# Altium project Q-Dice.PrjPcb
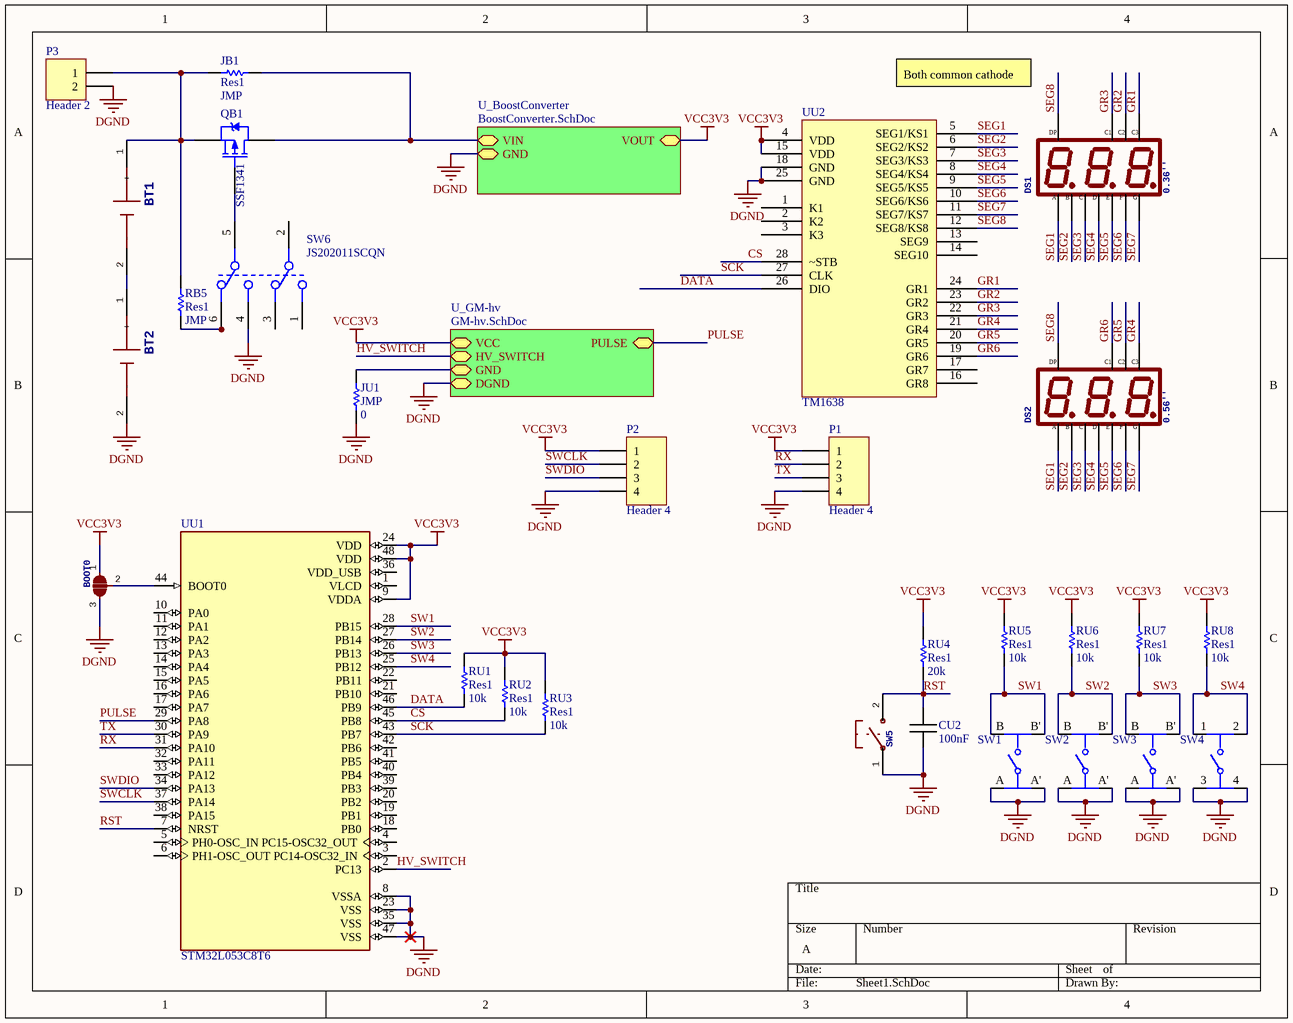
[diagram p0: Sheet1.SchDoc]
3 sheets, 71 parts. Net scope: strictly hierarchical (ports join the sheet entries above them; power ports are local).
Board file: Q-Dice.PcbDoc
Sheets:
  Sheet1.SchDoc
    U_GM-hv = GM-hv.SchDoc
    U_BoostConverter = BoostConverter.SchDoc

## Sheet Sheet1.SchDoc
size A

### Parts
BOOT0  2-Way Solder Jumper  [SOLDERJUMPER_2WAY_OPEN_NOPASTE]  (value not drawn)
BT1  Holder Cr2032 Gold Leads Smd  [AAA holder smd]  (value not drawn)
BT2  Holder Cr2032 Gold Leads Smd  [AAA holder smd]  (value not drawn)
CU2  100nF  [CAP0603R]
DS1  0.36''  [7-seg 3bit 0.36]
DS2  0.56''  [BA56-12EWA]
JB1  Res1  value JMP  [RES0603R]
JU1  JMP  value 0  [RES0603R]
P1  Header 4  [HDR1X4]
P2  Header 4  [HDR1X4]
P3  Header 2  [HDR1X2]
QB1  SSF1341  [SOT23]
RB5  Res1  value JMP  [RES0603R]
RU1  Res1  value 10k  [RES0603R]
RU2  Res1  value 10k  [RES0603R]
RU3  Res1  value 10k  [RES0603R]
RU4  Res1  value 20k  [RES0603R]
RU5  Res1  value 10k  [RES0603R]
RU6  Res1  value 10k  [RES0603R]
RU7  Res1  value 10k  [RES0603R]
RU8  Res1  value 10k  [RES0603R]
SW1  EVQ-PAE05R  [FP-EVQ-PAE05R-MFG]  (value not drawn)
SW2  EVQ-PAE05R  [FP-EVQ-PAE05R-MFG]  (value not drawn)
SW3  EVQ-PAE05R  [FP-EVQ-PAE05R-MFG]  (value not drawn)
SW4  FSM100  [FP-FSM100-MFG]  (value not drawn)
SW5  Switch  [PUSH_SMD_3x4]  (value not drawn)
SW6  JS202011SCQN  [JS202011SCQN]
UU1  STM32L053C8T6  [LQFP48_7X7MM_0.5MMPP]
UU2  TM1638  [SOP-28]

### Sub-sheets
U_BoostConverter = BoostConverter.SchDoc: VIN (bidir), GND (bidir), VOUT (bidir)
U_GM-hv = GM-hv.SchDoc: VCC (bidir), GND (bidir), PULSE (bidir), HV_SWITCH (bidir), DGND (bidir)

### Nets
DGND: BOOT0.3 BT2.2(-) CU2.2 JU1.1 P1.4 P2.4 P3.2 SW1.A SW1.A' SW2.A SW2.A' SW3.A SW3.A' SW4.3 SW4.4 SW5.1(P$1) SW6.4 UU1.8(VSSA) UU1.23(VSS) UU1.35(VSS) UU1.47(VSS) UU2.18(GND) UU2.25(GND) ; sheet U_GM-hv/DGND, sheet U_BoostConverter/GND
GND: JU1.2 ; sheet U_GM-hv/GND
VCC3V3: BOOT0.1 P1.1 P2.1 RU1.2 RU2.1 RU3.1 RU4.1 RU5.2 RU6.2 RU7.2 RU8.2 UU1.9(VDDA) UU1.24(VDD) UU1.48(VDD) UU2.4(VDD) UU2.15(VDD) ; sheet U_GM-hv/VCC, sheet U_BoostConverter/VOUT
CS: RU2.2 UU1.45(PB8) UU2.28(~STB)
DATA: RU1.1 UU1.46(PB9) UU2.26(DIO)
GR1: DS1.12(CA@3) UU2.24(GR1)
GR2: DS1.9(CA@2) UU2.23(GR2)
GR3: DS1.8(CA@1) UU2.22(GR3)
GR4: DS2.12(CA@3) UU2.21(GR4)
GR5: DS2.9(CA@2) UU2.20(GR5)
GR6: DS2.8(CA@1) UU2.19(GR6)
HV_SWITCH: UU1.2(PC13) ; sheet U_GM-hv/HV_SWITCH
PULSE: UU1.29(PA8) ; sheet U_GM-hv/PULSE
RST: CU2.1 RU4.2 SW5.2(P$2) UU1.7(NRST)
RX: P1.2 UU1.31(PA10)
SCK: RU3.2 UU1.43(PB7) UU2.27(CLK)
SEG1: DS1.11(A) DS2.11(A) UU2.5(SEG1/KS1)
SEG2: DS1.7(B) DS2.7(B) UU2.6(SEG2/KS2)
SEG3: DS1.4(C) DS2.4(C) UU2.7(SEG3/KS3)
SEG4: DS1.2(D) DS2.2(D) UU2.8(SEG4/KS4)
SEG5: DS1.1(E) DS2.1(E) UU2.9(SEG5/KS5)
SEG6: DS1.10(F) DS2.10(F) UU2.10(SEG6/KS6)
SEG7: DS1.5(G) DS2.5(G) UU2.11(SEG7/KS7)
SEG8: DS1.3(DP) DS2.3(DP) UU2.12(SEG8/KS8)
SW1: RU5.1 SW1.B SW1.B' UU1.28(PB15)
SW2: RU6.1 SW2.B SW2.B' UU1.27(PB14)
SW3: RU7.1 SW3.B SW3.B' UU1.26(PB13)
SW4: RU8.1 SW4.1 SW4.2 UU1.25(PB12)
SWCLK: P2.2 UU1.37(PA14)
SWDIO: P2.3 UU1.34(PA13)
TX: P1.3 UU1.30(PA9)
NetBOOT0_2: BOOT0.2 UU1.44(BOOT0)
NetBT1_1: BT1.1(+) JB1.2 P3.1 QB1.2(S) RB5.1
NetBT1_2: BT1.2(-) BT2.1(+)
NetJB1_1: JB1.1 QB1.3(D) ; sheet U_BoostConverter/VIN
NetQB1_1: QB1.1(G) SW6.5
NetRB5_2: RB5.2 SW6.6

Not connected (* = marked no-connect by the designer): SW6 1 2 3; UU1 1(VLCD) 3(PC14-OSC32_IN) 4(PC15-OSC32_OUT) 5(PH0-OSC_IN) 6(PH1-OSC_OUT) 10(PA0) 11(PA1) 12(PA2) 13(PA3) 14(PA4) 15(PA5) 16(PA6) 17(PA7) 18(PB0) 19(PB1) 20(PB2) 21(PB10) 22(PB11) 32(PA11) 33(PA12) 36(VDD_USB) 38(PA15) 39(PB3) 40(PB4) 41(PB5) 42(PB6); UU2 1(K1) 2(K2) 3(K3) 13(SEG9) 14(SEG10) 16(GR8) 17(GR7)

### Notes on the sheet
- Both common cathode
- (in symbol BA56-12EWA) C1; C2; C3

### Library data of the parts
BOOT0 = SOLDERJUMPER_2WAY0603
BT1 BT2 = BU2032SM-BT-GTR: MF: MPD; Price: 0.64 USD; Package: None; Availability: Good; MP: BU2032SM-BT-GTR
CU2 = Capacitor
DS1 DS2 = BA56-12EWA: MF: Kingbright; MP: BA56-12EWA; Availability: Good; Package: DIP-12 Kingbright; Price: 2.42 USD
JB1 JU1 RB5 RU1-RU8 = Res1: Resistor; Published: 8-Jun-2000; LatestRevisionDate: 17-Jul-2002; LatestRevisionNote: Re-released for DXP Platform.; PackageReference: AXIAL-0.3; Publisher: Altium Limited; PackageDescription: Axial Device, Thru-Hole; 2 Leads; 0.3 in Pin Spacing
P1 P2 = Header 4: Header, 4-Pin; LatestRevisionDate: 17-Jul-2002; LatestRevisionNote: Re-released for DXP Platform.; Publisher: Altium Limited
P3 = Header 2: Header, 2-Pin; LatestRevisionDate: 17-Jul-2002; LatestRevisionNote: Re-released for DXP Platform.; Publisher: Altium Limited
QB1 = PMOS: P-Channel Power MOSFET PMV65XP; Part Number: 1758119; Package: SOT23; Supplier: Farnell; ComponentLink1Description: Datasheet; ComponentLink1URL: http://www.farnell.com/datasheets/1719226.pdf
SW1-SW3 = CMP-05618-000051-1: SWITCH TACTILE SPST-NO 0.02A 15V; Contact Resistance: 50mR; Max Current Rating: 20mA; Electrical Life: 100000Cycles; Throw Configuration: SPST; Operating Force: 1.6N; Actuator Color: Red; Switch Travel: 0.25mm; Actuator Length: 1.1mm; Switch Function: Off-Mom; Illumination Type: Non-Illuminated; Actuator Type: Standard; Lead Free: Lead Free; Max Voltage Rating (DC): 15V; Package Quantity: 500; Packaging: Bulk; Depth: 7.8mm; Series: EVQPA; Radiation Hardening: No; Width: 6mm; Length: 6mm; Contact Current Rating: 20mA; Current Rating: 20mA; Min Operating Temperature: -20°C; Mechanical Life: 100000Cycles; Size: 6mm; Voltage Rating (DC): 15V; Mount: Through Hole; Contact Plating: Gold; Termination: PC Pin; Height: 5mm; Orientation: Straight; Max Operating Temperature: 70°C; Color: Red
SW4 = CMP-03402-000014-1: SWITCH TACTILE SPST-NO 0.05A 24V; Throw Configuration: SPST; Max Current Rating: 50mA; Switch Function: Off-Mom; Actuator Length: 6.35mm; Electrical Life: 100000Cycles; Max Voltage Rating (DC): 12V; Switch Travel: 0.3mm; Illumination Type: Non-Illuminated; Actuator Material: Polyester; Actuator Type: Standard; Actuator Color: Black; Contact Resistance: 100mR; Operating Force: 1.57N; Orientation: Straight; Contact Type: 1 maker; Current Rating: 50mA; Termination: PC Pins; Contact Current Rating: 50mA; Max Operating Temperature: 85°C; RoHS Compliant: Yes; Min Operating Temperature: -35°C; Contact Plating: Silver; Length: 12mm; Voltage Rating (DC): 24V; Type: Switch; Packaging: Loose Piece; Series: FSM100 ~ 104; Contact Material: Copper Alloy; Depth: 12.5mm; Lead Free: Lead Free; Mount: Through Hole; ELV: Compliant; Package Quantity: 400; Mechanical Life: 100000Cycles
SW5 = B3U-1000P: MANUFACTURER: Omron; DIGIKEY: SW1020CT-ND; MPN: B3U-1000P
SW6 = JS202011SCQN: SWITCH SLIDE DPDT 300MA 6V; Actuator Material: Nylon; Actuator Length: 2mm; Actuator Type: Standard; Contact Resistance: 70mR; Switch Function: On-On; Electrical Life: 5000Cycles; Voltage Rating (DC): 6V; Contact Current Rating: 300mA; Contact Plating: Silver; Throw Configuration: DPDT; REACH SVHC: No SVHC; Length: 9mm; Package Quantity: 1; Min Operating Temperature: -20°C; Contact Material: Copper Alloy; Switch Travel: 2mm; Radiation Hardening: No; Depth: 7.5mm; Packaging: Tape and Reel; Max Voltage Rating (DC): 6V; Housing Material: Nylon; Max Operating Temperature: 85°C; Current Rating: 300mA; Orientation: Vertical; Termination: Gull Wing; Flammability Rating: UL94 V-2; Lead Free: Lead Free; Mount: Surface Mount; Max Current Rating: 300mA
UU1 = STM32L053C8T6: ARMÂ® CortexÂ®-M0+ STM32L0 Microcontroller IC 32-Bit 32MHz 64KB _64K x 8_ FLASH 48-LQFP _7x7_; MF: STMicroelectronics; SnapEDA_Link: https://www.snapeda.com/parts/STM32L053C8T6/STMicroelectronics/view-part/552329/?ref=snap; Digi-Key_Purchase_URL: https://www.digikey.nl/product-detail/en/stmicroelectronics/STM32L053C8T6/497-14906-ND/4935255?utm_source=snapeda&utm_medium=aggregator&utm_campaign=symbol; MP: STM32L053C8T6; Digi-Key_Part_Number: 497-14906-ND; Value: *; Package: LQFP-48 STMicroelectronics
UU2 = TM1638: 7Seg and keyboard driver

## Sheet GM-hv.SchDoc
size A
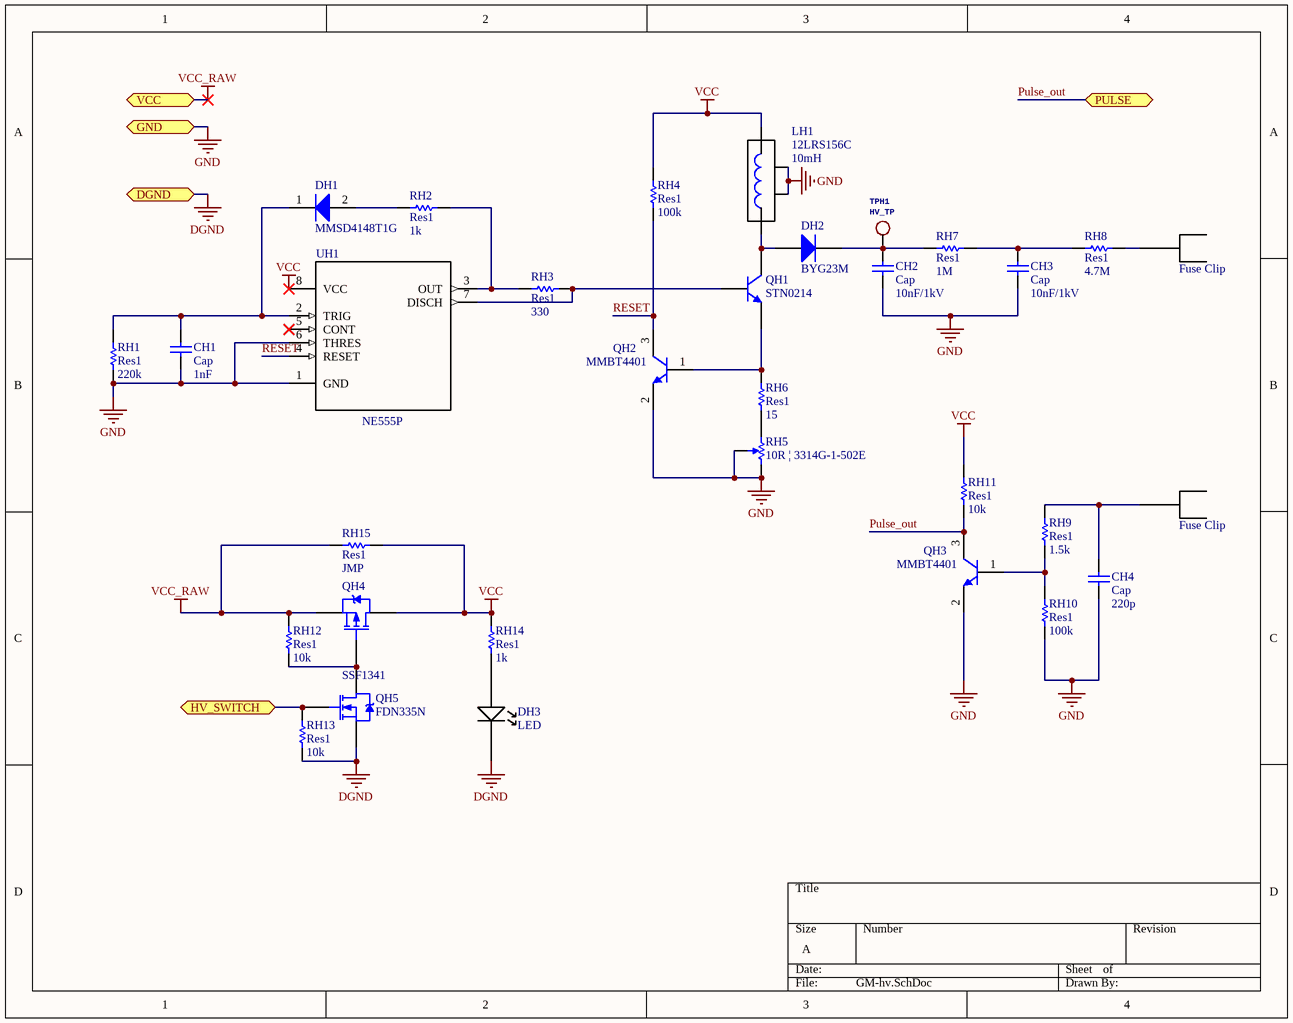
[diagram p1: GM-hv.SchDoc]

### Parts
CH1  Cap  value 1nF  [C 0603 / 1608]
CH2  Cap  value 10nF/1kV  [CAP1206R]
CH3  Cap  value 10nF/1kV  [CAP1206R]
CH4  Cap  value 220p  [C 0603 / 1608]
DH1  MMSD4148T1G  [ONSC-SOD-123-2-425-04_V]
DH2  BYG23M  [DO-214AC]
DH3  LED  [LED 0603]
JH1  Fuse Clip  [FUSE_BK-6003]
JH?  Fuse Clip  [FUSE_BK-6003]
LH1  12LRS156C  value 10mH  [IND_12LRS156C]
QH1  STN0214  [SOT-223-3 - NPN]
QH2  MMBT4401  [ONSC-SOT-23-3-318-08_M]
QH3  MMBT4401  [ONSC-SOT-23-3-318-08_M]
QH4  SSF1341  [SOT23]
QH5  FDN335N  [SOT23]
RH1  Res1  value 220k  [RES0603R]
RH2  Res1  value 1k  [RES0603R]
RH3  Res1  value 330  [RES0603R]
RH4  Res1  value 100k  [RES0603R]
RH5  10R | 3314G-1-502E  [BOUR-3314G-1_V]
RH6  Res1  value 15  [RES0603R]
RH7  Res1  value 1M  [RES0805R]
RH8  Res1  value 4.7M  [RES0805R]
RH9  Res1  value 1.5k  [RES0603R]
RH10  Res1  value 100k  [RES0603R]
RH11  Res1  value 10k  [RES0603R]
RH12  Res1  value 10k  [RES0603R]
RH13  Res1  value 10k  [RES0603R]
RH14  Res1  value 1k  [RES0603R]
RH15  Res1  value JMP  [RES0603R]
TPH1  HV_TP  [TESTPOINT_SMT]
UH1  NE555P  [SOIC-8]

### Ports
DGND (bidir), GND (bidir), HV_SWITCH (bidir), PULSE (bidir), VCC (bidir)

### Nets
DGND: DH3.2(-) QH5.2(S) RH13.1 ; port DGND
GND: CH1.1 CH2.1 CH3.1 CH4.1 LH1.2(GND) LH1.4(GND) QH2.2(E) QH3.2(E) RH1.1 RH5.2 RH5.3 RH10.1 UH1.1(GND) UH1.6(THRES) ; port GND
VCC: LH1.3 QH4.3(D) RH4.2 RH11.2 RH14.2 RH15.1 UH1.8(VCC)
VCC_RAW: QH4.2(S) RH12.2 RH15.2 ; port VCC  [project net VCC3V3]
HV_SWITCH: QH5.1(G) RH13.2 ; port HV_SWITCH
Pulse_out: QH3.3(C) RH11.1 ; port PULSE  [project net PULSE]
RESET: QH2.3(C) RH4.1 UH1.4(RESET)
NetCH1_2: CH1.2 DH1.1(K) RH1.2 UH1.2(TRIG)
NetCH2_2: CH2.2 DH2.2(K) RH7.1 TPH1.P$1
NetCH3_2: CH3.2 RH7.2 RH8.1
NetCH4_2: CH4.2 JH?.1(PIN) RH9.2
NetDH1_2: DH1.2(A) RH2.1
NetDH2_1: DH2.1(A) LH1.1 QH1.1(C)
NetDH3_1: DH3.1(+) RH14.1
NetJH1_1: JH1.1(PIN) RH8.2
NetQH1_2: QH1.2(B) RH3.2 UH1.7(DISCH)
NetQH1_3: QH1.3(E) QH2.1(B) RH6.2
NetQH3_1: QH3.1(B) RH9.1 RH10.2
NetQH4_1: QH4.1(G) QH5.3(D) RH12.1
NetRH2_2: RH2.2 RH3.1 UH1.3(OUT)
NetRH5_1: RH5.1 RH6.1

Not connected (* = marked no-connect by the designer): UH1 5(CONT)*

### Library data of the parts
CH1-CH4 = Cap: Capacitor; Published: 8-Jun-2000; LatestRevisionDate: 17-Jul-2002; LatestRevisionNote: Re-released for DXP Platform.; PackageReference: RAD-0.3; Publisher: Altium Limited; PackageDescription: Radial Cap, Thru-Hole; 2 Leads; 0.3 in Pin Spacing
DH1 = CMP-0895-00001-2: Switching Diode, 2-Pin SOD-123, Pb-Free, Tape and Reel; Manufacturer: On Semiconductor; trr Max (ns): 4; IF Max (A): 0.2; Configuration: Single; Mounting Technology: Surface Mount; ComponentLink2URL: http://www.onsemi.com/pub_link/Collateral/MMSD4148T1-D.PDF; ComponentLink1Description: Manufacturer URL; ComponentLink1URL: http://www.onsemi.com/; PartNumber: MMSD4148T1G; ComponentLink2Description: Datasheet; PackageDescription: 2-Pin SOD, Body 1.6 x 2.69 mm; Packing: Tape and Reel; DatasheetVersion: Rev. 11; PackageReference: SOD-123-2-425-04; ComponentLink3Description: Package Specification; ComponentLink3URL: http://www.onsemi.com/pub_link/Collateral/425-04.PDF; PackageVersion: Rev. G, 10/2009; RoHS: TRUE
DH2 = Diode: Default Diode; Published: 8-Jun-2000; LatestRevisionDate: 17-Jul-2002; LatestRevisionNote: Re-released for DXP Platform.; PackageVersion: Sep-1996; PackageReference: SMC; Publisher: Altium Limited; PackageDescription: DO-214-AB/SMC; 2 C-Bend Leads; Body 7.9 x 5.9 mm, inc. leads (LxW); Code_JEDEC: DO-214-AB
LH1 = Inductor_Shielded: Inductor; Code_IEC: 1005; Published: 8-Jun-2000; LatestRevisionDate: 29-May-2009; LatestRevisionNote: IPC-7351 Footprint Added.; PackageReference: 0402-A; Publisher: Altium Limited; PackageDescription: Chip Inductor; Code_JEITA: 0402
QH1 = NPN: NPN Bipolar Transistor; Published: 8-Jun-2000; LatestRevisionDate: 17-Jul-2002; LatestRevisionNote: Re-released for DXP Platform.; PackageReference: TO-226-AA; Publisher: Altium Limited; PackageDescription: TO, Flat Index; 3 In-Line, Axial Leads; Body Dia. 4.8mm; Leads 0.55 x 0.51 mm (max); Code_JEDEC: TO-226-AA
QH2 QH3 = CMP-0722-00001-1: General Purpose Transistor, NPN, 0.6 A IC Continuous, 3-Pin SOT23, RoHS, Tape and Reel; Manufacturer: ON Semiconductor; PartNumber: MMBT2222LT1G; PTM Max.: 0.225 W; HFE Max.: 300; HFE Min.: 100; V(BR) CEO: 30 V Min.; FT: 250 MHz; IC Continuous: 0.6 A; RoHS: TRUE; DatasheetVersion: Rev. 10; PackageVersion: Rev. AP; Polarity: NPN; PackageReference: SOT-23-3; PackageDescription: 3-Pin SOT23, Body 2.9 x 1.3 mm, Pitch 0.95 mm; ComponentLink1URL: http://www.onsemi.com/; ComponentLink2URL: http://www.onsemi.com/pub_link/Collateral/MMBT2222LT1-D.PDF; ComponentLink3URL: http://www.onsemi.com/pub_link/Collateral/MMBT2222LT1-D.PDF; Mounting Technology: Surface Mount; ComponentLink3Description: Package Specification; ComponentLink1Description: Manufacturer URL; Packing: Tape and Reel; ComponentLink2Description: Datasheet
QH4 = PMOS: as QB1 on sheet Sheet1; Package: SOT23; Supplier: Farnell; ComponentLink1Description: Datasheet; ComponentLink1URL: http://www.farnell.com/datasheets/1719226.pdf
QH5 = NMOS: N-Channel Power MOSFET PMV30UN; Part Number: 2469652; Package: SOT23; Supplier: Farnell; ComponentLink1Description: Datasheet; ComponentLink1URL: http://www.farnell.com/datasheets/1885685.pdf
RH1-RH4 RH6-RH15 = Res1: Resistor; Published: 8-Jun-2000; LatestRevisionDate: 17-Jul-2002; LatestRevisionNote: Re-released for DXP Platform.; PackageReference: AXIAL-0.3; Publisher: Altium Limited; PackageDescription: Axial Device, Thru-Hole; 2 Leads; 0.3 in Pin Spacing
RH5 = CMP-2000-05589-1: 4 mm Square Trimpot(R) Trimming Potentiometer, 5 KOhm, +/- 20%, 0.25 W, -55 to 125 degC, 3-Pin SMD, RoHS, Tape and Reel; Manufacturer: Bourns; Power: 250; Angle of rotation: 240°; Dielectric strength: 500; Resistance: 5; Curve: linear; Package Description: 3-Pin Surface Mount Device, Body 4.5 x 4.5 mm, Pitch 1.15 mm; Package Reference: 3314G-1; Mounting Technology: SurfaceMount; Datasheet URL: http://www.bourns.com/docs/Product-Datasheets/3314.pdf; Datasheet Version: 05/2016; Tolerance: ±20%; Manufacturer URL: http://www.bourns.com/; Temperature range: -55...+125°C; Package: GullWing
TPH1 = TESTPOINT
UH1 = NE555P: MF: Texas Instruments; Price: None; Package: PDIP-8 STMicroelectronics; SnapEDA_Link: https://www.snapeda.com/parts/NE555P/Texas%20Instruments/view-part/?ref=snap; Availability: Unavailable; MP: NE555P; Value: *

## Sheet BoostConverter.SchDoc
size A
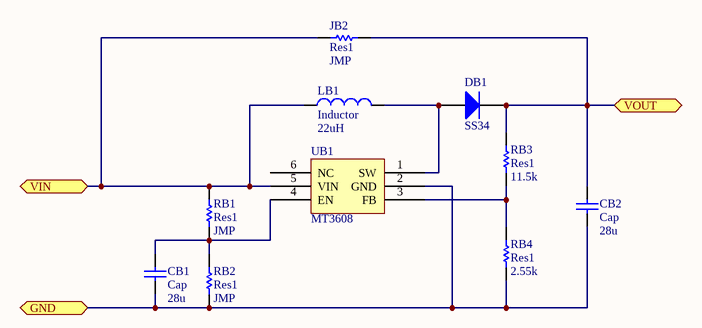
[diagram p2: BoostConverter.SchDoc]

### Parts
CB1  Cap  value 28u  [CAP0603R]
CB2  Cap  value 28u  [CAP0603R]
DB1  SS34  [DO-214AC]
JB2  Res1  value JMP  [RES0603R]
LB1  Inductor  value 22uH  [INDUCTOR CD54]
RB1  Res1  value JMP  [RES0603R]
RB2  Res1  value JMP  [RES0603R]
RB3  Res1  value 11.5k  [RES0603R]
RB4  Res1  value 2.55k  [RES0603R]
UB1  MT3608  [SOT23-6]

### Ports
GND (bidir), VIN (bidir), VOUT (bidir)

### Nets
DGND: CB1.1 CB2.1 RB2.2 RB4.2 UB1.2(GND) ; port GND
VCC3V3: CB2.2 DB1.2(K) JB2.2 RB3.1 ; port VOUT
NetCB1_2: CB1.2 RB1.2 RB2.1 UB1.4(EN)
NetDB1_1: DB1.1(A) LB1.2 UB1.1(SW)
NetJB1_1: JB2.1 LB1.1 RB1.1 UB1.5(VIN) ; port VIN
NetRB3_2: RB3.2 RB4.1 UB1.3(FB)

Not connected (* = marked no-connect by the designer): UB1 6(NC)

### Library data of the parts
CB1 CB2 = Cap: Capacitor; Published: 8-Jun-2000; LatestRevisionDate: 17-Jul-2002; LatestRevisionNote: Re-released for DXP Platform.; PackageReference: RAD-0.3; Publisher: Altium Limited; PackageDescription: Radial Cap, Thru-Hole; 2 Leads; 0.3 in Pin Spacing
DB1 = Diode: Default Diode; Published: 8-Jun-2000; LatestRevisionDate: 17-Jul-2002; LatestRevisionNote: Re-released for DXP Platform.; PackageVersion: Sep-1996; PackageReference: SMC; Publisher: Altium Limited; PackageDescription: DO-214-AB/SMC; 2 C-Bend Leads; Body 7.9 x 5.9 mm, inc. leads (LxW); Code_JEDEC: DO-214-AB
JB2 RB1-RB4 = Res1: Resistor; Published: 8-Jun-2000; LatestRevisionDate: 17-Jul-2002; LatestRevisionNote: Re-released for DXP Platform.; PackageReference: AXIAL-0.3; Publisher: Altium Limited; PackageDescription: Axial Device, Thru-Hole; 2 Leads; 0.3 in Pin Spacing
LB1 = Inductor: Code_IEC: 1005; Published: 8-Jun-2000; LatestRevisionDate: 29-May-2009; LatestRevisionNote: IPC-7351 Footprint Added.; PackageReference: 0402-A; Publisher: Altium Limited; PackageDescription: Chip Inductor; Code_JEITA: 0402
UB1 = MT3608: Boost converter

## Nets that join several sheets
DGND: Sheet1 (23 pins), GM-hv (DH3.2 QH5.2 RH13.1), BoostConverter (5 pins)
GND: Sheet1 (JU1.2), GM-hv (14 pins)
VCC3V3: Sheet1 (16 pins), GM-hv (QH4.2 RH12.2 RH15.2), BoostConverter (CB2.2 DB1.2 JB2.2 RB3.1)
HV_SWITCH: Sheet1 (UU1.2), GM-hv (QH5.1 RH13.2)
NetJB1_1: Sheet1 (JB1.1 QB1.3), BoostConverter (JB2.1 LB1.1 RB1.1 UB1.5)
PULSE: Sheet1 (UU1.29), GM-hv (QH3.3 RH11.1)